# EAGLE design tad (EAGLE 5.11)
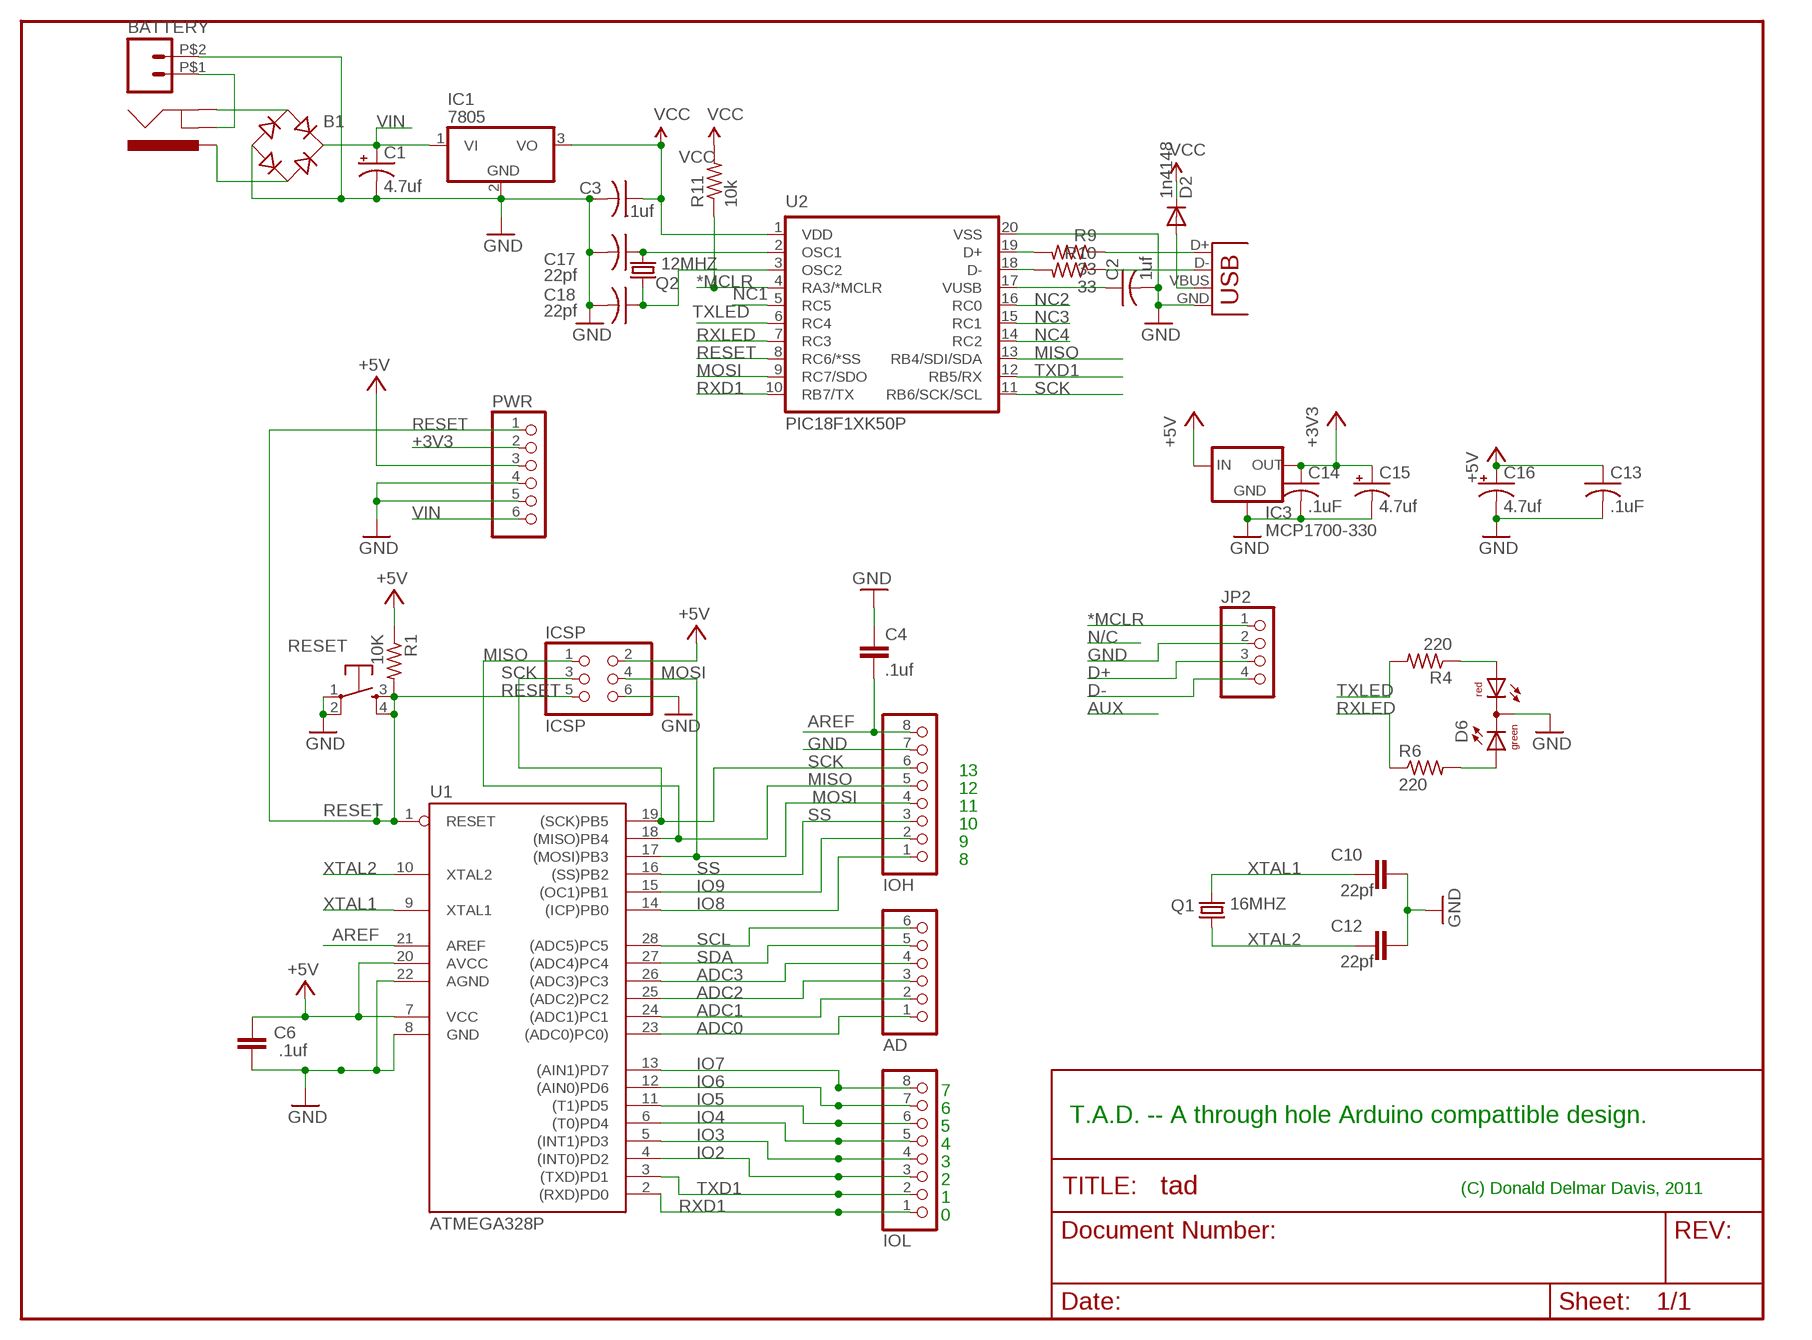
[diagram p0: schematic, sheet 1]

## Parts
AD  PINHD-1X6  [1X06]
B1  B-DIL  [B-DIL]
BATTERY  M02  [1X02_BIG]
C1  4.7uf  CPOL-USE2.5-5  [E2,5-5]
C2  1uf  C-US025-030X050  [C025-030X050]
C3  .1uf  C-US025-030X050  [C025-030X050]
C4  .1uf  C-EU025-025X050  [C025-025X050]
C6  .1uf  C-EU025-025X050  [C025-025X050]
C10  22pf  C-EU025-025X050  [C025-025X050]
C12  22pf  C-EU025-025X050  [C025-025X050]
C13  .1uF  C-US025-025X050  [C025-025X050]
C14  .1uF  C-US025-025X050  [C025-025X050]
C15  4.7uf  CPOL-USE2.5-5  [E2,5-5]
C16  4.7uf  CPOL-USE2.5-5  [E2,5-5]
C17  22pf  C-US025-030X050  [C025-030X050]
C18  22pf  C-US025-030X050  [C025-030X050]
D2  1n4148  DIODEPTH2  [DOIDE-1N4148]
D6  DUOLED2X5  [DUOLED2X5]
IC1  7805  7824T  [TO220H]
IC3  MCP1700-330  MCP1700TRI  [TO92]
ICSP  ICSP  PINHD-2X3  [2X03]
IOH  PINHD-1X8  [1X08]
IOL  PINHD-1X8  [1X08]
J1  POWER_JACKPTH  [POWER_JACK_PTH]
JP2  PINHD-1X4  [1X04]
PWR  PINHD-1X6  [1X06]
Q1  16MHZ  CRYSTALHC49S  [HC49/S]
Q2  12MHZ  CRYSTALHC49S  [HC49/S]
R1  10K  R-US_0204/5  [0204/5]
R4  220  R-US_0204/5  [0204/5]
R6  220  R-US_0204/5  [0204/5]
R9  33  R-US_0204/5  [0204/5]
R10  33  R-US_0204/5  [0204/5]
R11  10k  R-US_0204/5  [0204/5]
RESET  TAC_SWITCHPTH  [TACTILE-PTH]
U1  ATMEGA328P  AT90S4433P  [DIL28-3]
U2  PIC18F1XK50P  PIC18F/LF1XK50P  [DIL20]
X3  USB-3DPTH  [USB-B-PTH]

## Nets
*MCLR: JP2.1 R11.1 U2.4(RA3/*MCLR)
+3V3: C14.1 C15.+ IC3.3(OUT) PWR.2
ADC0: AD.1 U1.23((ADC0)PC0))
ADC1: AD.2 U1.24((ADC1)PC1)
ADC2: AD.3 U1.25((ADC2)PC2)
ADC3: AD.4 U1.26((ADC3)PC3)
AREF: C4.2 IOH.8 U1.21(AREF)
D+: JP2.3 R9.2 U2.19(D+)
D-: JP2.4 R10.2 U2.18(D-)
GND: B1.- BATTERY.P$2 C1.- C2.2 C3.2 C4.1 C6.1 C10.1 C12.1 C13.2 C14.2 C15.- C16.- C17.2 C18.2 D6.K(C) IC1.2(GND) IC3.1(GND) ICSP.6 IOH.7 JP2.2 PWR.4 PWR.5 RESET.1 RESET.2 U1.8(GND) U1.22(AGND) U2.20(VSS) X3.GND
IO2: IOL.3 U1.4((INT0)PD2)
IO3: IOL.4 U1.5((INT1)PD3)
IO4: IOL.5 U1.6((T0)PD4)
IO5: IOL.6 U1.11((T1)PD5)
IO6: IOL.7 U1.12((AIN0)PD6)
IO7: IOL.8 U1.13((AIN1)PD7)
IO8: IOH.1 U1.14((ICP)PB0)
IO9: IOH.2 U1.15((OC1)PB1)
MISO: ICSP.1 IOH.5 U1.18((MISO)PB4) U2.13(RB4/SDI/SDA)
MOSI: ICSP.4 IOH.4 U1.17((MOSI)PB3) U2.9(RC7/SDO)
N$2: D6.AR R4.1
N$3: C2.1 U2.17(VUSB)
N$6: B1.AC2 J1.PWR
N$7: B1.AC1 J1.GND
N$8: R9.1 X3.D+
N$9: R10.1 X3.D-
N$10: C17.1 Q2.2 U2.2(OSC1)
N$11: D2.A X3.VBUS
N$12: BATTERY.P$1 J1.GNDBREAK
N$14: D6.AG R6.2
N$15: C18.1 Q2.1 U2.3(OSC2)
NC1: U2.5(RC5)
NC2: U2.16(RC0)
NC3: U2.15(RC1)
NC4: U2.14(RC2)
RESET: ICSP.5 PWR.1 R1.2 RESET.3 RESET.4 U1.1(RESET) U2.8(RC6/*SS)
RXD1: IOL.1 U1.2((RXD)PD0) U2.10(RB7/TX)
RXLED: R6.1 U2.7(RC3)
SCK: ICSP.3 IOH.6 U1.19((SCK)PB5) U2.11(RB6/SCK/SCL)
SCL: AD.6 U1.28((ADC5)PC5)
SDA: AD.5 U1.27((ADC4)PC4)
SS: IOH.3 U1.16((SS)PB2)
TXD1: IOL.2 U1.3((TXD)PD1) U2.12(RB5/RX)
TXLED: R4.2 U2.6(RC4)
VCC: C3.1 C6.2 C13.1 C16.+ D2.C IC1.3(VO) IC3.2(IN) ICSP.2 PWR.3 R1.1 R11.2 U1.7(VCC) U1.20(AVCC) U2.1(VDD) ; supply symbol labelled +5V
VIN: B1.+ C1.+ IC1.1(VI) PWR.6
XTAL1: C10.2 Q1.2 U1.9(XTAL1)
XTAL2: C12.2 Q1.1 U1.10(XTAL2)

## Notes on the sheet
- 13
- 12
- 11
- 10
- 9
- 8
- 7
- 6
- T.A.D. -- A through hole Arduino compattible design.
- 5
- 4
- 3
- 2
- (C) Donald Delmar Davis, 2011
- 1
- 0

## Library data of the parts
AD PWR = pinhead:PINHD-1X6: PIN HEADER
B1 = rectifier:B-DIL: RECTIFIER
BATTERY = 3d:M02: Header 2 Standard 2-pin 0.1" header. Use with straight break away headers (SKU : PRT-00116), right angle break away headers (PRT-00553), swiss pins (PRT-00743), machine pins (PRT-00117), and female headers (PRT-00115). Molex polarized connector foot print use with SKU : PRT-08233 with associated crimp pins and housings.
C1 C15 C16 = adafruit:CPOL-US: POLARIZED CAPACITOR, American symbol
C2 C3 C17 C18 = rcl:C-US: CAPACITOR, American symbol
C4 C6 C10 C12 = SmartPrj:C-EU: CAPACITOR, European symbol
C13 C14 = adafruit:C-US: CAPACITOR, American symbol
D2 = 3d:DIODE: Diode These are standard reverse protection diodes and small signal diodes. SMA package can handle up to about 1A. SOD-323 can handle about 200mA. What the SOD-323 package when ordering, there are some mfgs out there that are 5-pin packages.
D6 = led:DUOLED2X5: DUO LED 2 colors, 2.5 x 5 mm, recangle
IC1 = linear:78*: Positive VOLTAGE REGULATOR Source: http://cache.national.com/ds/LM/LM78L05.pdf http://www.fairchildsemi.com/ds/LM/LM7805.pdf
IC3 = adafruit:MCP1700: VOLTAGE REGULATOR
ICSP = pinhead:PINHD-2X3: PIN HEADER
IOH IOL = pinhead:PINHD-1X8: PIN HEADER
J1 = 3d:POWER_JACK: Power Jack This is the standard 5.5mm barrel jack for power. The PTH is the most common, proven, reliable, footprint. All others are experimental. The Slot footprint only works if the mill layer is transmitted to the PCB fab house so be warned. Spark Fun Electronics SKU : PRT-00119. Mating wall wart : TOL-00298 (and others)
JP2 = 3d2010:PINHD-1X4: PIN HEADER
Q1 Q2 = crystal:CRYSTAL: CRYSTAL
R1 R4 R6 = adafruit:R-US_: RESISTOR, American symbol
R9 R10 = rcl:R-US_: RESISTOR, American symbol
R11 = resistor:R-US_: RESISTOR, American symbol
RESET = 3d:TAC_SWITCH: Momentary Switch Button commonly used for reset or general input. Spark Fun Electronics SKU : COM-00097
U1 = atmel:AT90S4433: MICROCONTROLLER 4 Kbytes FLASH 128 bytes SRAM 256 bytes EEPROM UART 6-channel 10 bit ADC
U2 = mcp2200plus:PIC18F/LF1XK50: 20 pin USB flash Microcontroller.
X3 = 3d2010:USB-3D: USB Connectors USB-B-PTH is fully proven SKU : PRT-00139 USB-miniB is fully proven SKU : PRT-00587 USB-A-PCB is untested. USB-A-H is throughly reviewed, but untested. Spark Fun Electronics SKU : PRT-00437 USB-B-SMT is throughly reviewed, but untested. Needs silkscreen touching up. USB-A-S has not been used/tested USB-MB-H has not been used/tested

## Net classes
0 default: width 0.203 mm
1 vcc: width 0.254 mm
2 gnd: width 0.305 mm, drill 0.711 mm, clearance 0.203 mm

## Board
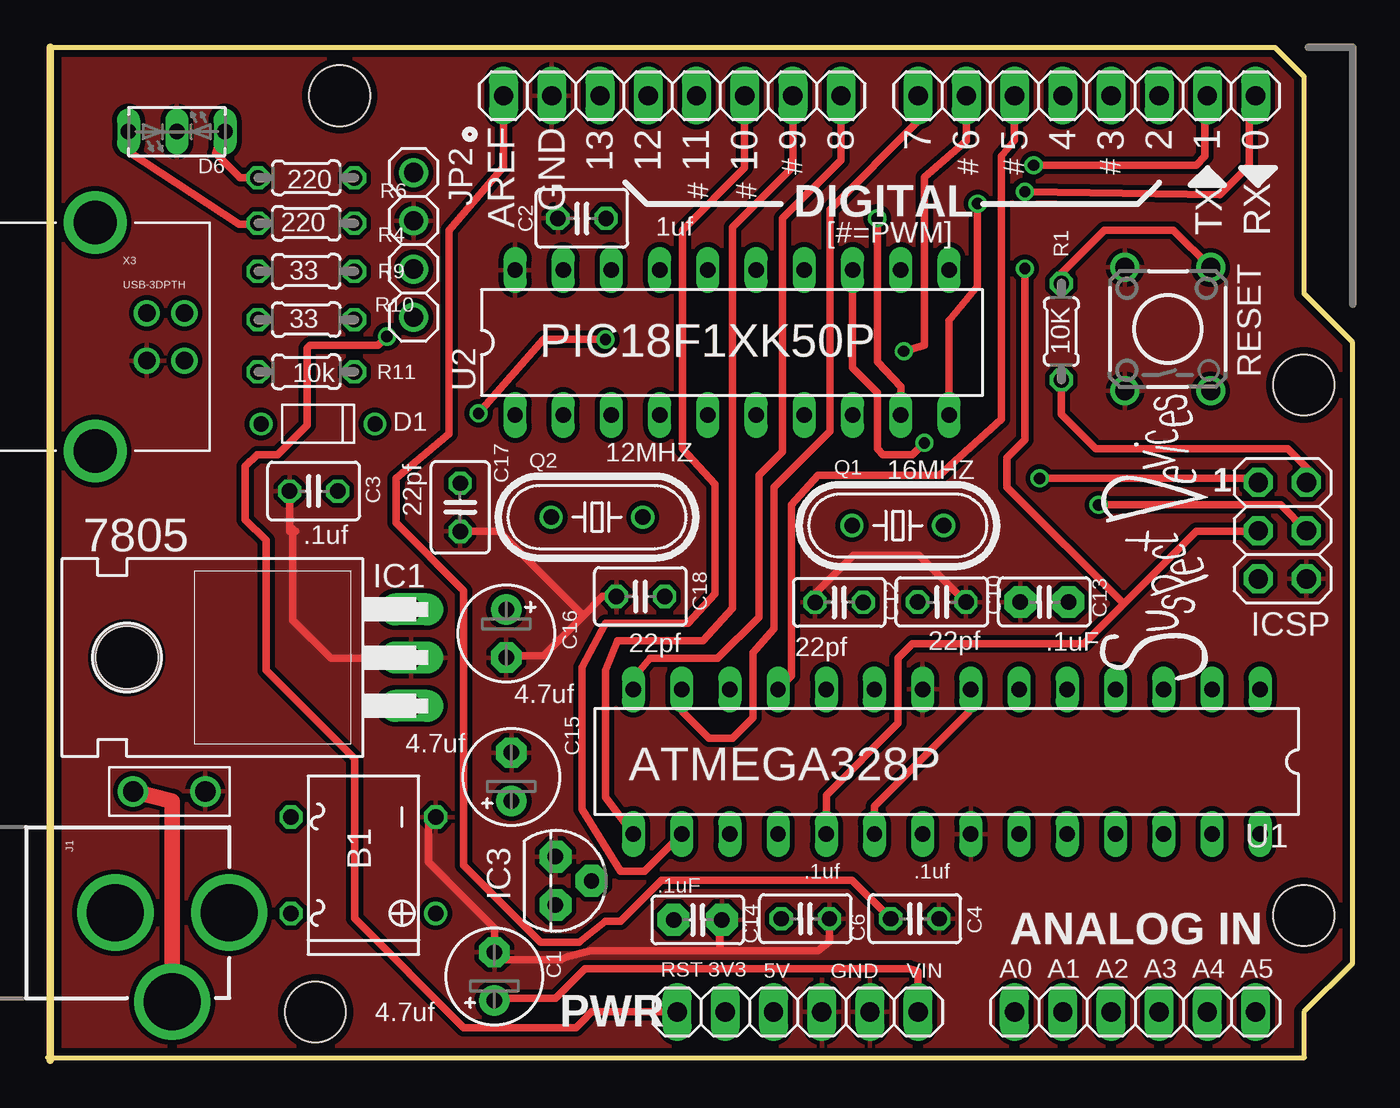
[diagram p1: board, top side]
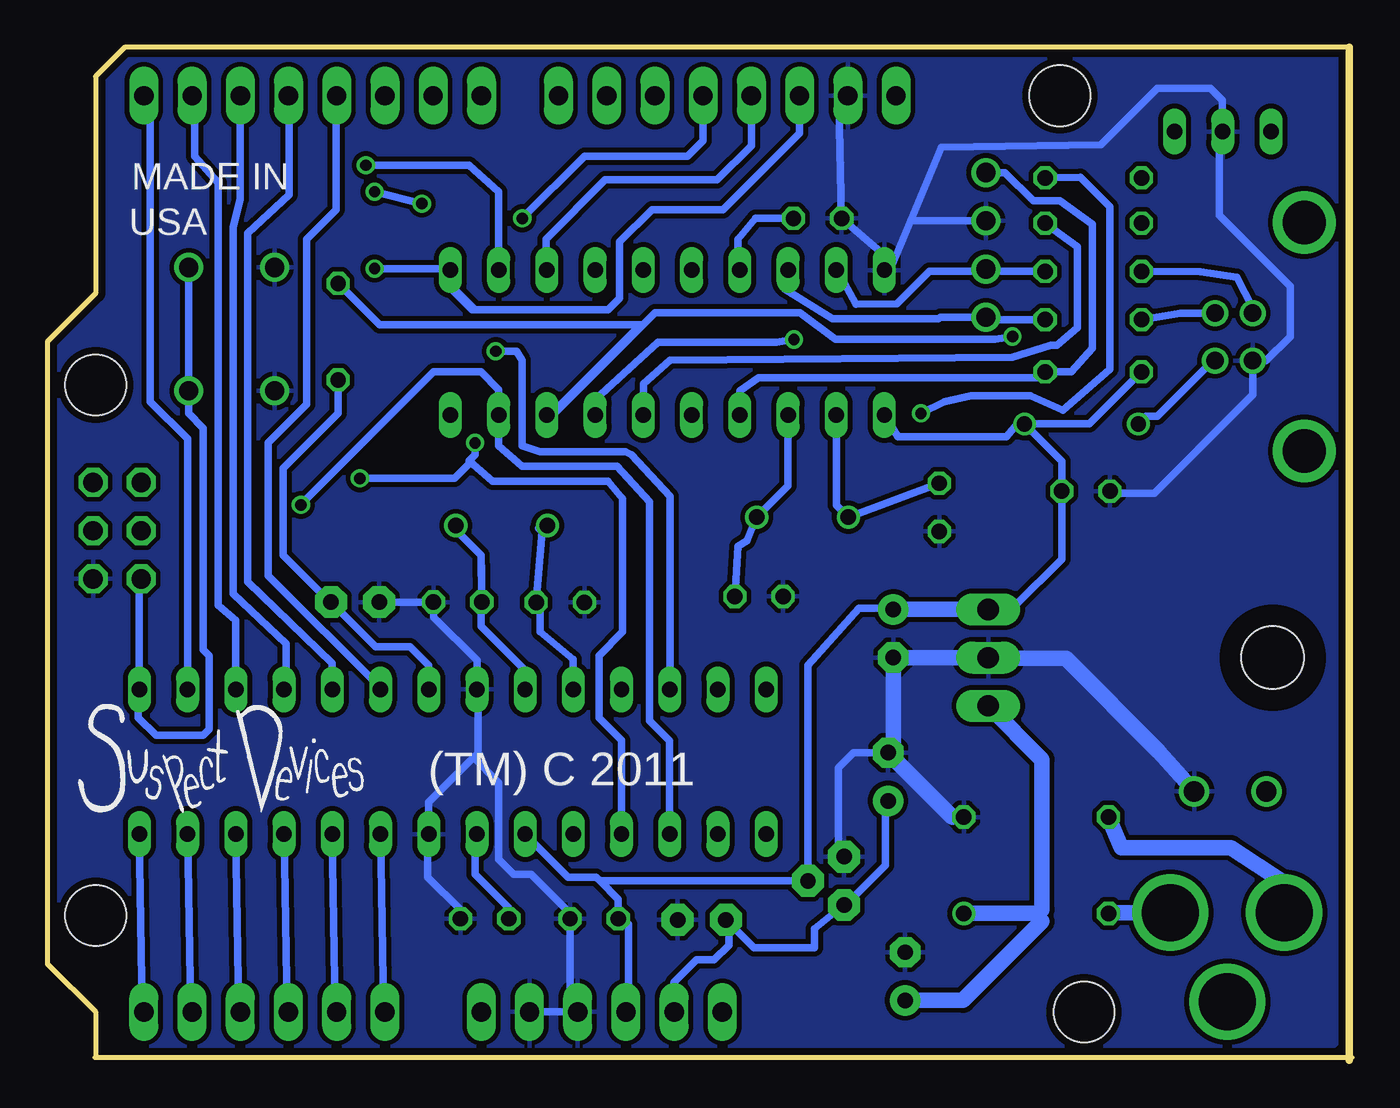
[diagram p2: board, bottom side, seen from below]

Size 68.74 x 53.34 mm. Coordinates in mm from the lower left corner, seen from the top.
Outline: 66.2,0.16 66.2,2.54 68.74,5.08 68.74,37.85 66.2,40.39 66.2,51.82 64.67,53.34 0.16,53.34 0.16,0
Outline: 0,0.13 66.23,0.13
Copper layers (1*16): Top 0.0356mm / dielectric 1.5011mm / Bottom 0.0356mm
Design rules "LaenPCBOrder": minimum track width 6mil, minimum drill 13mil, track to track 6mil, track to pad 6mil, pad to pad 6mil, via to via 6mil, smd to smd 6mil, copper to edge 15mil, drill to drill 6mil, minimum pad ring 7mil, minimum via ring 7mil, stop-mask expansion 4mil, vias tented up to drill 0mil, thermal gap 10mil
Holes 3.2 mm at 66.2,35.56 66.2,7.62 15.4,50.8 14.13,2.54
vRestrict: area 48,10.3 to 48.7,10.8; area 50.6,10.2 to 51.1,11

### Footprints (pad centres in the part's own frame; a part is rotated, then mirrored left to right if it is on the bottom)
1X06 = drill 1.016 long: 1 -6.35,0; 2 -3.81,0; 3 -1.27,0; 4 1.27,0; 5 3.81,0; 6 6.35,0
B-DIL = drill 0.813 round: + -2.54,-3.81 | drill 0.813 octagon: - 2.54,-3.81; AC1 2.54,3.81; AC2 -2.54,3.81
1X02_BIG = drill 1.067 round: P$1 0,0; P$2 3.81,0
E2,5-5 = drill 0.813 pad 1.6 round: + -1.27,0 | drill 0.813 pad 1.6 octagon: - 1.27,0
C025-030X050 = drill 0.813 octagon: 1 -1.27,0; 2 1.27,0
C025-025X050 = drill 0.813 octagon: 1 -1.27,0; 2 1.27,0
C025-025X050' = drill 0.813 pad 1.676 octagon: 1 -1.27,0; 2 1.27,0
DOIDE-1N4148 = drill 0.8 round: A 3,0; C -3,0
DUOLED2X5 = drill 0.813 long: AG -2.54,0; AR 2.54,0; K 0,0
TO220H = drill 1.118 long: 1 -2.54,-10.16; 2 0,-10.16; 3 2.54,-10.16 | hole 3.302: 0,4.826
TO92 = drill 0.813 pad 1.676 octagon: 1 -1.27,0; 2 0,1.905; 3 1.27,0
2X03 = drill 1.016 octagon: 1 -2.54,-1.27; 2 -2.54,1.27; 3 0,-1.27; 4 0,1.27; 5 2.54,-1.27; 6 2.54,1.27
1X08 = drill 1.016 long: 1 -8.89,0; 2 -6.35,0; 3 -3.81,0; 4 -1.27,0; 5 1.27,0; 6 3.81,0; 7 6.35,0; 8 8.89,0
POWER_JACK_PTH = drill 2.997 round: GND 0,7.7; GNDBREAK 4.7,10.7; PWR 0,13.7
1X04 = drill 1.016 round: 1 -3.81,0; 2 -1.27,0; 3 1.27,0; 4 3.81,0
HC49/S = drill 0.813 round: 1 -2.413,0; 2 2.413,0
0204/5 = drill 0.813 octagon: 1 -2.54,0; 2 2.54,0
TACTILE-PTH = drill 1.016 round: 1 -3.251,2.261; 2 3.251,2.261; 3 -3.251,-2.261; 4 3.251,-2.261
DIL28-3 = drill 0.813 long: 1 -16.51,-3.81; 2 -13.97,-3.81; 3 -11.43,-3.81; 4 -8.89,-3.81; 5 -6.35,-3.81; 6 -3.81,-3.81; 7 -1.27,-3.81; 8 1.27,-3.81; 9 3.81,-3.81; 10 6.35,-3.81; 11 8.89,-3.81; 12 11.43,-3.81; 13 13.97,-3.81; 14 16.51,-3.81; 15 16.51,3.81; 16 13.97,3.81; 17 11.43,3.81; 18 8.89,3.81; 19 6.35,3.81; 20 3.81,3.81; 21 1.27,3.81; 22 -1.27,3.81; 23 -3.81,3.81; 24 -6.35,3.81; 25 -8.89,3.81; 26 -11.43,3.81; 27 -13.97,3.81; 28 -16.51,3.81
DIL20 = drill 0.813 long: 1 -11.43,-3.81; 2 -8.89,-3.81; 3 -6.35,-3.81; 4 -3.81,-3.81; 5 -1.27,-3.81; 6 1.27,-3.81; 7 3.81,-3.81; 8 6.35,-3.81; 9 8.89,-3.81; 10 11.43,-3.81; 11 11.43,3.81; 12 8.89,3.81; 13 6.35,3.81; 14 3.81,3.81; 15 1.27,3.81; 16 -1.27,3.81; 17 -3.81,3.81; 18 -6.35,3.81; 19 -8.89,3.81; 20 -11.43,3.81
USB-B-PTH = drill 0.914 round: D+ 0,1.25; D- 1.981,1.25; GND 0,-1.25; VBUS 1.981,-1.25 | drill 2.286 round: P$1 -2.718,-6.02; P$2 -2.718,6.02

### Placement (x,y rotation side)
AD  57.31,2.54 0 top
B1  16.65,10.27 90 top
BATTERY  4.51,14.16 0 top
C1  23.55,4.42 90 top
C2  28.16,44.34 180 top
C3  14.03,29.97 180 top
C4  45.7,7.45 180 top
C6  39.93,7.45 180 top
C10  47.12,24.13 180 top
C12  41.72,24.11 0 top
C13  .1uF  [C025-025X050']  52.53,24.13 180 top
C14  .1uF  [C025-025X050']  34.26,7.39 0 top
C15  24.44,14.93 90 top
C16  24.17,22.47 270 top
C17  21.75,29.12 270 top
C18  31.25,24.43 180 top
D2  14.26,33.51 180 top
D6  6.82,48.91 180 top
IC1  9.01,21.2 90 top
IC3  26.76,9.45 270 top
ICSP  65.07,27.89 270 top
IOH  32.92,50.8 180 top
IOL  54.77,50.8 180 top
J1  -4.12,7.78 270 top
JP2  19.29,42.94 270 top
PWR  39.53,2.54 0 top
Q1  44.81,28.16 0 top
Q2  28.95,28.6 180 top
R1  53.42,38.38 90 top
R4  13.63,44.09 0 top
R6  13.63,46.47 180 top
R9  13.63,41.55 0 top
R10  13.63,39.01 0 top
R11  13.63,36.26 180 top
RESET  59.03,38.51 90 top
U1  47.38,15.72 180 top
U2  36.07,37.8 0 top
X3  5.24,38.1 0 top

### Tracks (layer width: path | path; a pad name or v marks a point on that pad's centre or on a via)
*MCLR
  Bottom 0.406: U2.4 32.26,35.26 31.27,35.94 16.18,35.94 R11.1 14.78,36.25 13.69,37.49 13.69,44.03 15.4,45.27 16.8,45.27 18.28,46.75 JP2.1
+3V3
  Bottom 0.406: PWR.2 35.72,4.11 34.54,5.29 33.6,5.29 32.83,6.07 32.83,7.23 C14.1 31.51,5.91 28.31,5.91 28.31,6.94 IC3.3 26.67,8.18 24.58,10.27 24.58,13.52 C15.+
ADC0
  Bottom 0.406: U1.23 51.03,2.62 AD.1
ADC1
  Bottom 0.406: U1.24 53.57,2.62 AD.2
ADC2
  Bottom 0.406: U1.25 56.11,2.62 AD.3
ADC3
  Bottom 0.406: U1.26 58.65,2.62 AD.4
AREF
  Top 0.406: IOH.8 24.03,47.06 21.16,43.72 21.16,32.98 18.36,30.65 18.36,28.32 21.94,24.74 21.94,10.27 25.98,6.22 28,6.22 29.4,7.31 30.18,7.31 32.36,9.49 42.39,9.49 C4.2
  Bottom 0.406: C4.2 44.43,8.03 46.21,9.8 46.21,11.82 U1.21
D+
  Bottom 0.406: U2.19 27.07,41.5 26.14,39.83 23.97,39.84 22.26,41.55 R9.2 19.17,41.55 JP2.3
D-
  Bottom 0.406: 29.87,41.76 29.87,40.6 27.38,39.05 21.78,39.05 21.7,39.13 JP2.4 19.17,39.01 R10.2 | 29.87,41.76 29.87,42.32 | 29.87,41.76 U2.18
GND
  Top 0.406: C14.2 35.38,6.79 35.47,5.76 | 35.47,5.76 28.63,5.76 27.38,5.45 27.07,5.29 23.94,5.29 | C3.2 12.76,27.85 13.07,27.85 12.91,28 12.91,23.18 14.94,21.16 19.71,21.16 19.76,21.2 IC1.2 | 35.47,5.76 40.61,5.76 41.2,6.25 C6.1 | C1.- 23.55,6.95 20.07,10.42 20.07,12.42 B1.- | C18.2 29.25,24.43 28.24,23.41 | 28.24,23.41 26.14,21.31 24.28,21.31 C16.- | C17.2 23.8,27.85 28.24,23.41 | C12.1 40.45,24.58 42.47,26.6 45.92,26.6 C10.1
  Bottom 0.406: IOH.7 27.04,50.33 C2.2 24.64,42.4 U2.20 24.35,41.61 23.25,44.23 | 46.28,15.95 48.65,13.58 U1.22 48.69,11.87 48.69,9.65 46.97,7.92 C4.1 | 46.28,15.95 46.05,16.18 46.05,19.47 U1.8 46.11,21.06 48.38,23.34 48.38,24.12 C10.1 | 46.28,15.95 44.96,14.62 44.96,10.58 44.18,9.8 43.25,9.8 41.2,7.75 C6.1 41.2,2.95 PWR.4 PWR.5 | 24.17,16.47 C15.- 26.28,16.2 27.07,15.4 27.07,10.72 IC3.1 | 21.06,12.81 B1.- | C3.2 12.66,29.87 10.42,29.87 5.24,35.06 X3.GND 4.53,36.85 3.27,38.12 3.27,40.76 7,44.49 7,48.72 D6.K 6.85,48.94 6.85,50.56 7.47,51.18 10.27,51.18 13.22,48.23 21.62,48.07 23.25,44.23 | C10.1 C13.2 | C10.1 | 19.12,21.16 IC1.2 | JP2.2 23.22,44.21 23.25,44.23
  Bottom 0.813: IC1.2 C16.- 24.17,16.47 | C15.- 21.06,12.81 | BATTERY.P$2 10.19,16.26 15.09,21.16 19.12,21.16
  pour Bottom (isolate 0.254, rank 2): 0.47,54.29 67.53,54.29 74.01,54.32 73.86,-1.08 1.04,0.64 0.79,0.89 0.79,30.48 -0.16,30.8 -0.16,44.45 0.16,45.09
  pour Top (isolate 0.254, rank 2): 0.79,54.29 76.11,53.67 71.68,-0.61 0.79,0.64 0.79,30.48 0.16,29.21 0.16,45.09 0.79,46.35
IO2
  Bottom 0.406: IOL.3 58.58,45.35 58.96,43.87 58.96,24.58 56.16,21.94 56.16,19.64 U1.4
IO3
  Bottom 0.406: U1.5 53.73,20.9 58.18,25.2 58.18,43.56 56.01,45.58 56.01,50.77 IOL.4
IO4
  Bottom 0.406: U1.6 51.19,19.61 57.1,25.51 57.1,32.52 55.07,34.54 55.07,43.25 53.52,44.81 53.52,50.78 IOL.5
IO5
  Top 0.406: IOL.6 50.96,48.47 50.25,47.61 50.25,33.76 46.98,30.8 40.61,30.8 39.2,29.25 39.2,20.25 U1.11
IO6  (via drill 0.6)
  Top 0.406: IOL.7 48.42,48.42 46.21,46.52 46.21,37.65 v45.12,37.34
  Bottom 0.406: U1.12 35.94,19.55 35.94,29.71 37.96,31.89 38.27,32.05 42.78,32.05 43.72,32.36 43.72,36.87 44.03,37.34 v45.12,37.34
IO7
  Top 0.406: IOL.8 45.88,49.45 41.23,44.81 41.23,33.14 38.27,30.18 38.27,22.71 37.18,21.47 37.18,18.05 36.09,16.96 34.85,16.96 33.45,18.36 33.45,19.49 U1.13
IO8
  Top 0.406: IOH.1 41.81,47.41 38.74,44.34 38.74,32.05 37.49,30.8 37.49,23.34 35.32,21.16 31.74,21.16 30.96,20.23 30.96,19.44 U1.14
IO9
  Top 0.406: IOH.2 39.27,47.05 36.09,43.87 36.09,23.8 34.54,22.09 30.03,22.09 29.4,20.54 29.4,13.85 U1.15
MISO  (via drill 0.6)
  Top 0.406: U2.13 42.42,36.46 43.72,35.16 43.72,32.2 44.03,31.89 45.58,31.89 v46.21,32.52 | v52.27,30.65 63.58,30.65 ICSP.1
  Bottom 0.406: IOH.5 31.65,48.16 33.45,46.36 39.36,46.36 42.47,43.25 42.47,41.67 U2.13 | U1.18 38.49,16.86 39.67,18.05 39.67,21.31 38.43,22.56 38.43,29.56 39.2,30.49 45.27,30.49 46.52,31.58 | v46.21,32.52 46.21,31.89 46.52,31.58 | 46.52,31.58 46.52,31.43 47.29,30.65 v52.27,30.65
MOSI  (via drill 0.6)
  Top 0.406: v43.72,44.34 43.72,36.79 44.96,35.47 U2.9 | v55.38,29.25 64.98,29.25 ICSP.4
  Bottom 0.406: IOH.4 34.19,48.42 35,47.61 40.45,47.61 v43.72,44.34 | U1.17 35.95,16.82 37.03,17.89 37.03,29.4 38.74,31.27 43.72,31.27 44.96,32.36 U2.9 | U2.9 | U2.9 44.96,35.32 45.89,36.25 48.38,36.25 v55.38,29.25
N$2
  Top 0.406: D6.AR 4.28,47.84 10.11,44.03 11.03,44.03 R4.1
N$3
  Bottom 0.406: C2.1 31.43,44.34 32.36,43.25 32.36,41.71 U2.17
N$6
  Bottom 0.406: 12.79,7.78 B1.AC2
  Bottom 0.813: J1.PWR 12.79,7.78
N$7
  Bottom 0.813: J1.GND 3.58,9.34 6.38,11.2 12.16,11.2 B1.AC1
N$8
  Bottom 0.406: X3.D+ 5.24,39.62 6.07,41.23 7.99,41.54 R9.1
N$9
  Bottom 0.406: X3.D- 9.04,39.35 R10.1
N$10
  Bottom 0.406: U2.2 27.18,29.24 Q2.2 C17.1
N$11
  Bottom 0.406: X3.VBUS 7.33,36.85 10.27,33.91 10.85,33.91 D2.A
N$12
  Top 0.813: J1.GNDBREAK 6.58,13.65 BATTERY.P$1
N$14
  Top 0.406: R6.2 10.16,46.47 8.87,47.76 9.18,48.73 D6.AG
N$15
  Bottom 0.406: U2.3 29.72,30.25 Q2.1 31.87,27.36 32.36,27.07 C18.1
RESET  (via drill 0.6)
  Top 0.406: PWR.1 28.68,2.54 28.16,2.02 | 28.16,2.02 | 28.16,2.02 27.85,1.71 21.94,1.71 16.18,7.47 16.18,15.87 11.51,20.54 11.51,27.38 10.42,28.47 10.42,31.27 11.05,31.89 12.13,31.89 13.69,33.45 13.69,37.49 13.85,37.65 17.42,37.65 17.74,37.96 v17.89,38.12 | R1.2 53.42,41.44 55.7,43.72 59.33,43.72 RESET.4
  Bottom 0.406: 42.24,33.99 U2.8 | 42.24,33.99 37.49,38.74 51.24,38.74 R1.2 | 42.24,33.99 42.08,33.99 36.72,39.36 29.09,39.36 27.23,37.96 18.82,37.96 v17.89,38.12 | ICSP.5 63.89,25.25 U1.1 63.94,19.48 63.94,18.05 63.01,17.11 60.52,17.11 60.21,17.42 60.21,21.31 60.52,21.62 60.52,33.29 61.29,34.06 RESET.3 RESET.4
RXD1  (via drill 0.6)
  Top 0.406: U2.10 47.5,38.94 49.01,40.76 v49.01,45.12 | v51.5,45.74 61.76,45.58 63.32,47.14 63.32,50.46 IOL.1
  Bottom 0.406: U1.2 61.35,32.72 63.32,34.69 63.32,50.46 IOL.1 | v49.01,45.12 v51.5,45.74
RXLED  (via drill 0.6)
  Top 0.406: v29.4,37.96 26.14,37.96 v22.71,34.07
  Bottom 0.406: R6.1 14.31,46.52 12.76,44.96 12.76,36.41 15.25,34.23 16.96,35 20.07,35 21.47,34.69 v22.71,34.07 | U2.7 39.88,34.8 36.56,37.8 30.34,37.8 v29.4,37.96
SCK  (via drill 0.6)
  Top 0.406: U1.19 41.03,13.96 44.81,17.74 44.81,21.16 45.58,21.94 54.61,21.94 56.71,24.04 | 56.71,24.04 60.52,27.85 63.75,27.85 ICSP.3 | v51.5,41.69 51.5,32.67 50.56,31.74 50.56,30.18 56.71,24.04
  Bottom 0.406: IOH.6 29.11,48.83 33.14,44.81 36.87,44.81 38.58,43.09 38.58,40.14 39.2,39.52 46.21,39.52 | 46.21,39.52 47.61,40.92 47.61,41.5 U2.11 | 46.21,39.52 46.36,39.52 47.61,40.76 47.61,41.69 v51.5,41.69
SCL
  Bottom 0.406: U1.28 63.73,2.62 AD.6
SDA
  Bottom 0.406: U1.27 61.19,2.62 AD.5
SS
  Top 0.406: IOH.3 36.73,47 33.45,43.72 33.45,32.2 35.16,30.34 35.16,24.58 33.76,23.02 29.4,23.02 28.16,20.69 28.16,13.22 30.18,9.96 31.45,9.96 U1.16
TXD1  (via drill 0.6)
  Top 0.406: v51.96,47.14 60.52,47.14 60.99,47.61 60.99,50.67 IOL.2
  Bottom 0.406: U1.3 58.81,23.18 59.74,23.96 59.74,46.21 60.99,47.61 60.99,50.67 IOL.2 | U2.12 44.96,45.74 46.52,47.14 v51.96,47.14
TXLED
  Bottom 0.406: U2.6 37.34,35.63 35.94,36.87 17.89,37.03 15.87,37.65 15.56,37.65 14.47,38.58 14.47,42.85 R4.2
VCC
  Top 0.406: U1.20 43.57,13.39 48.54,18.36 48.54,19.42 U1.7 | R1.1 53.42,34.01 55.23,32.2 65.34,32.2 66.43,31.11 66.43,30.52 ICSP.2
  Bottom 0.406: C16.+ 23.65,23.74 23.71,23.8 25.98,23.8 28.67,20.81 IC3.2 39.63,9.45 | 39.63,9.45 38.66,8.48 C6.2 38.41,7.45 38.12,7.16 38.12,2.68 PWR.3 | U1.20 41.3,9.65 39.83,9.65 39.63,9.45 | D2.C 17.64,33.51 18.2,32.83 23.94,32.83 U2.1 | D2.C 13.84,33.51 R11.2 | D2.C 15.3,31.55 C3.1 15.3,26.4 17.74,23.96 18.95,23.96 IC1.3 | U1.7 48.65,20.8 49.63,21.78 51.44,21.78 C13.1 53.85,24.13 56.32,26.6 56.32,31.17 53.42,34.07 R1.1
  Bottom 0.813: 23.65,23.74 IC1.3
VIN
  Top 0.406: PWR.6 45.88,4.69 45.43,4.82 28.31,4.82 26.76,3.27 23.67,3.27 C1.+
  Bottom 0.406: 16.34,7.31 16.34,7.93 16.54,7.73
  Bottom 0.813: C1.+ 20.5,3.15 16.34,7.31 | 16.34,7.93 16.34,15.83 IC1.1 | 16.54,7.73 B1.+
XTAL1
  Bottom 0.406: U1.9 43.57,20.55 45.89,22.87 45.89,24.09 C10.2 45.85,25.51 | 45.85,25.51 45.85,26.03 | Q1.2 47.61,28.32 45.89,26.6 45.89,25.56 45.85,25.51
XTAL2
  Bottom 0.406: U1.10 41.03,21.12 42.78,22.56 42.78,23.91 C12.2 42.68,27.84 | 42.68,27.84 42.68,27.93 | Q1.1 42.86,28.02 42.68,27.84

### Text on the board
tPlace: 13 | 12 | 11 | 10 | 9 | 8 | 7 | 6 | 5 | 4 | 3 | 2 | 1 | 0
tNames: AREF | GND | # | # | # | # | # | # | DIGITAL | [#=PWM] | TX | RX | D1 | 1 | ANALOG IN | RST | 3V3 | 5V | GND | VIN | A0 | A1 | A2 | A3 | A4 | A5
bNames: MADE IN | USA | (TM) C 2011
tValues: + | -
214bmp: D:/SmartProjects/Snc/a4_bn_logo2.bmp